# EAGLE design pi-shield (EAGLE 6.6.0)
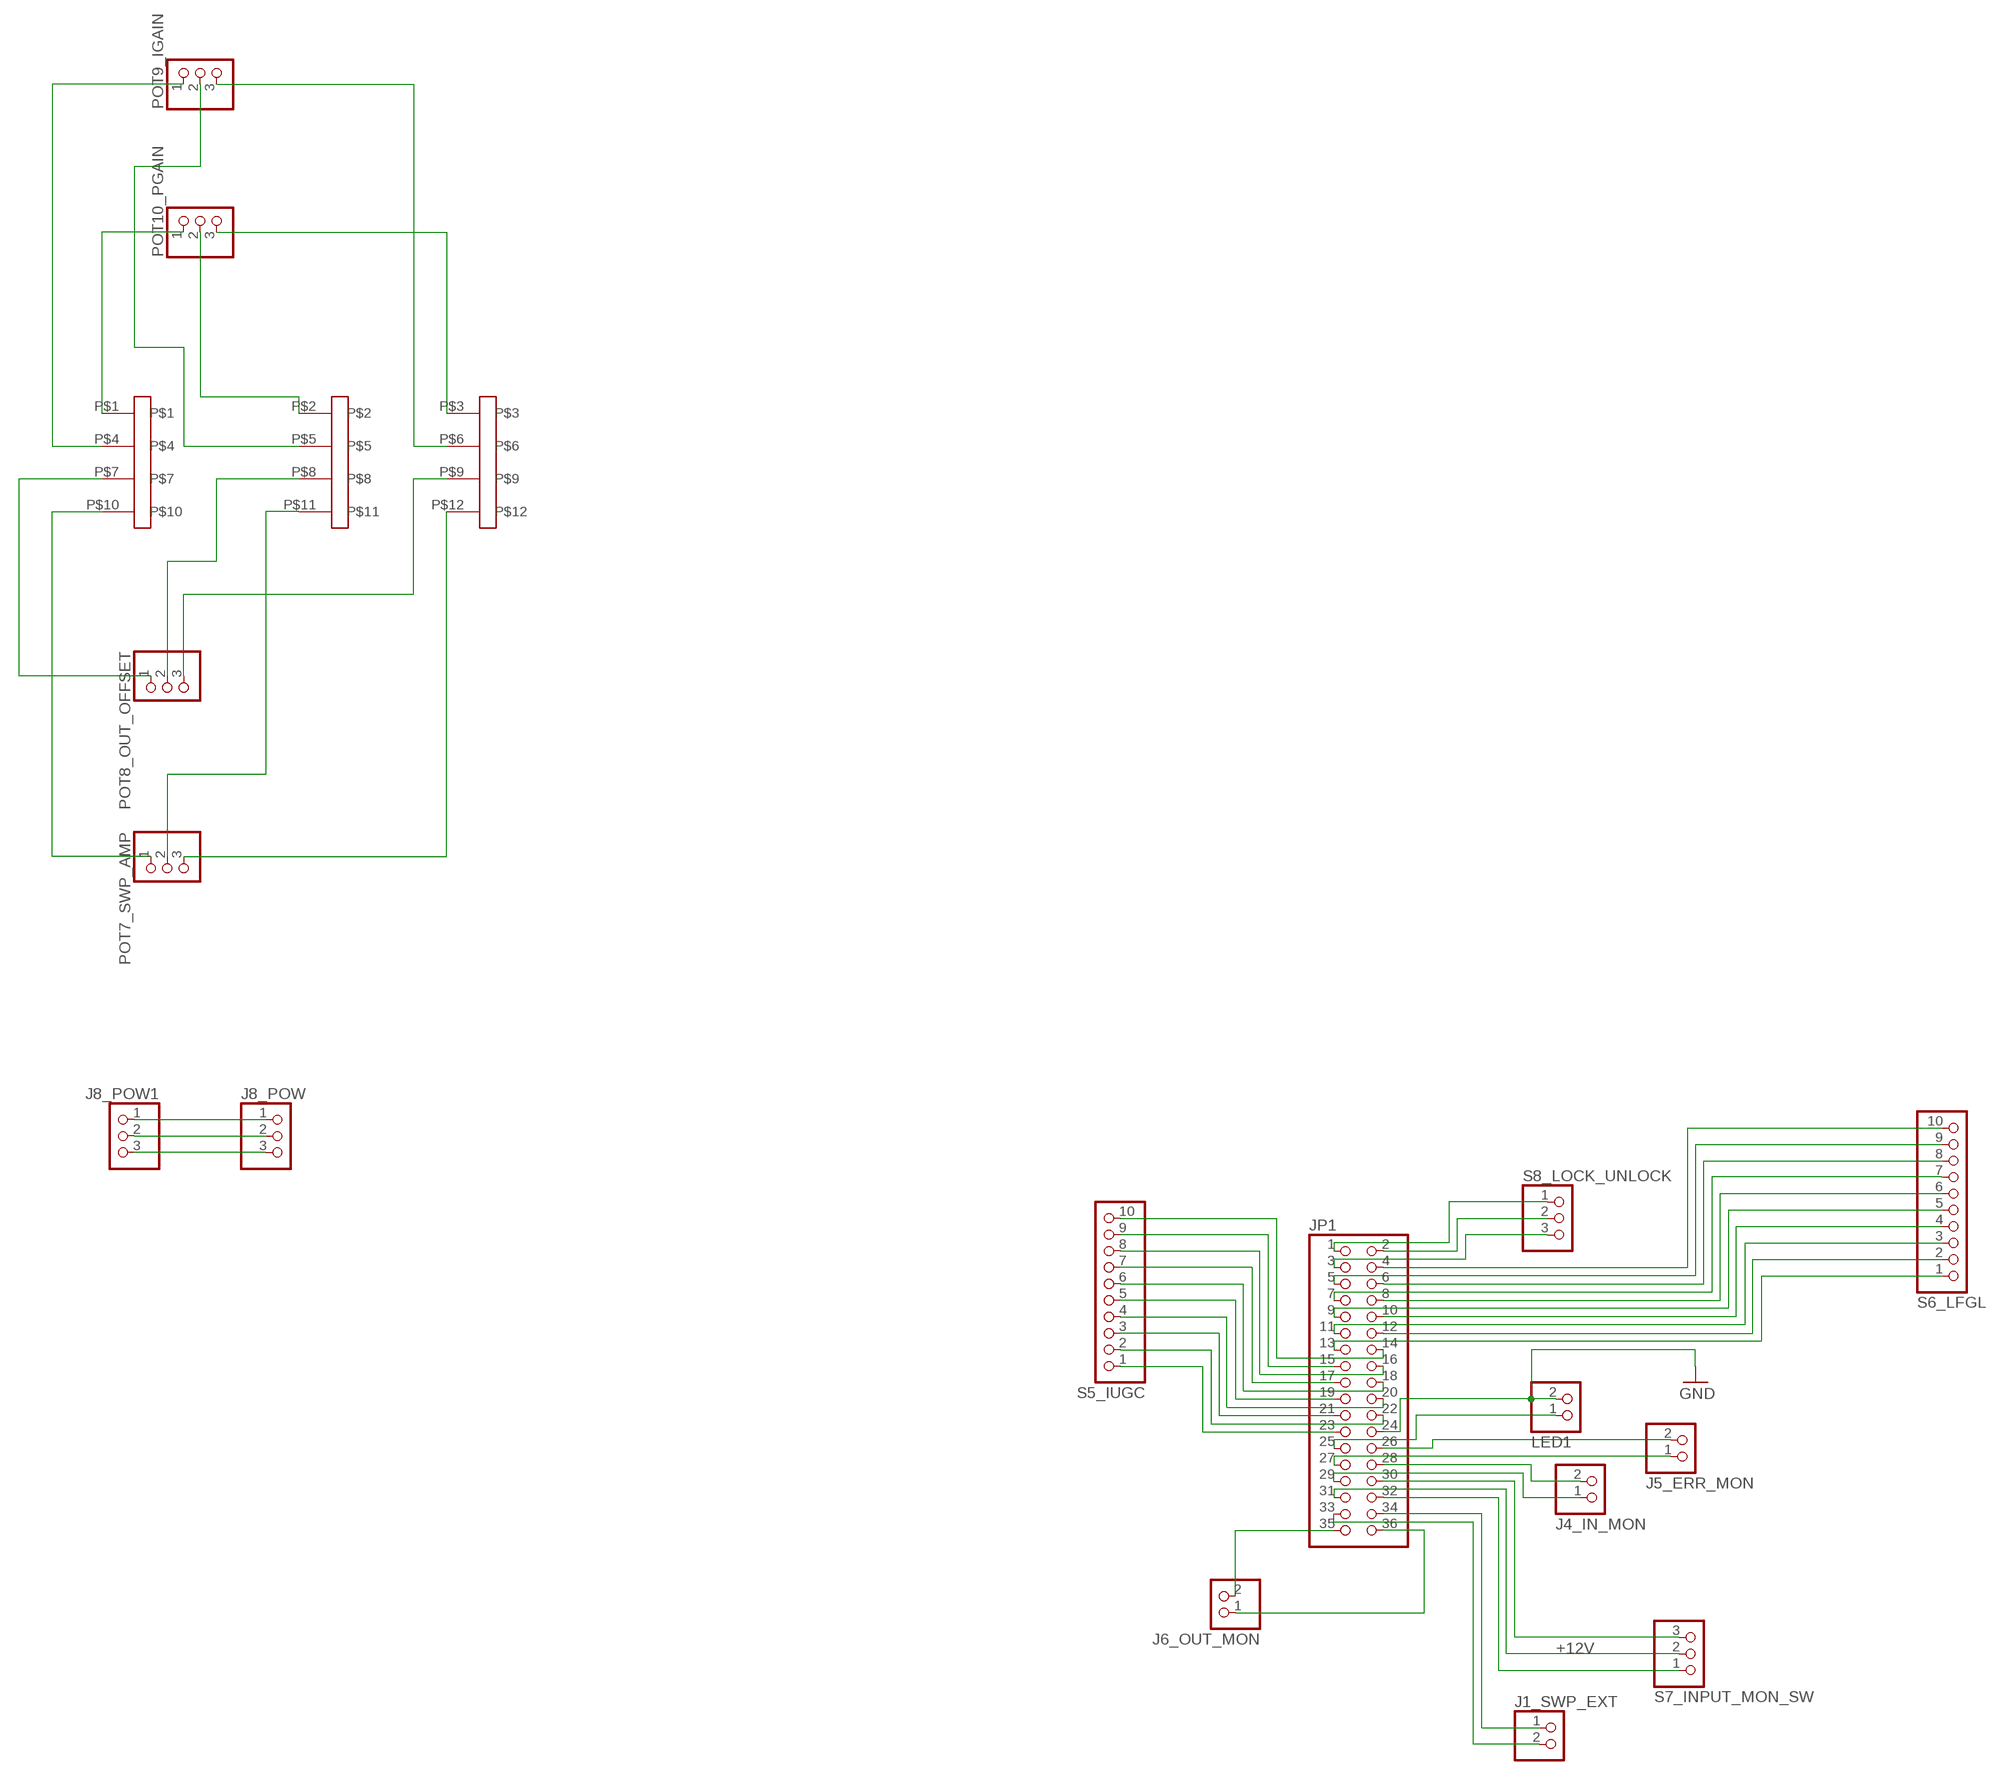
[diagram p0: schematic, sheet 1]

## Parts
J1  PINHD-3X4  [3X04]
J1_SWP_EXT  PINHD-1X2  [1X02]
J4_IN_MON  PINHD-1X2  [1X02]
J5_ERR_MON  PINHD-1X2  [1X02]
J6_OUT_MON  PINHD-1X2  [1X02]
J8_POW  PINHD-1X3  [1X03]
J8_POW1  PINHD-1X3  [1X03]
JP1  PINHD-2X18/90  [2X18/90]
LED1  PINHD-1X2  [1X02]
POT7_SWP_AMP  PINHD-1X3  [1X03]
POT8_OUT_OFFSET  PINHD-1X3  [1X03]
POT9_IGAIN  PINHD-1X3  [1X03]
POT10_PGAIN  PINHD-1X3  [1X03]
S5_IUGC  PINHD-1X10  [1X10]
S6_LFGL  PINHD-1X10  [1X10]
S7_INPUT_MON_SW  PINHD-1X3  [1X03]
S8_LOCK_UNLOCK  PINHD-1X3  [1X03]

## Nets
+12V: JP1.31 S7_INPUT_MON_SW.2
GND: JP1.24 LED1.2
N$1: J8_POW1.1 J8_POW.1
N$2: J8_POW1.2 J8_POW.2
N$3: J8_POW1.3 J8_POW.3
N$4: J1.P$1 POT10_PGAIN.1
N$5: J1.P$2 POT10_PGAIN.2
N$6: J1.P$3 POT10_PGAIN.3
N$7: J1.P$4 POT9_IGAIN.1
N$8: J1.P$5 POT9_IGAIN.2
N$9: J1.P$6 POT9_IGAIN.3
N$10: J1.P$7 POT8_OUT_OFFSET.1
N$11: J1.P$8 POT8_OUT_OFFSET.2
N$12: J1.P$9 POT8_OUT_OFFSET.3
N$13: J1.P$10 POT7_SWP_AMP.1
N$14: J1.P$11 POT7_SWP_AMP.2
N$15: J1.P$12 POT7_SWP_AMP.3
N$16: J1_SWP_EXT.1 JP1.34
N$17: J1_SWP_EXT.2 JP1.33
N$18: J5_ERR_MON.2 JP1.26
N$19: J5_ERR_MON.1 JP1.27
N$20: J4_IN_MON.2 JP1.28
N$21: J4_IN_MON.1 JP1.29
N$22: JP1.30 S7_INPUT_MON_SW.3
N$23: JP1.32 S7_INPUT_MON_SW.1
N$24: JP1.4 S6_LFGL.10
N$25: JP1.5 S6_LFGL.9
N$26: JP1.6 S6_LFGL.8
N$27: JP1.7 S6_LFGL.7
N$28: JP1.8 S6_LFGL.6
N$29: JP1.9 S6_LFGL.5
N$30: JP1.10 S6_LFGL.4
N$31: JP1.11 S6_LFGL.3
N$32: JP1.12 S6_LFGL.2
N$33: JP1.13 S6_LFGL.1
N$34: JP1.14 S5_IUGC.10
N$35: JP1.15 S5_IUGC.9
N$36: JP1.1 S8_LOCK_UNLOCK.1
N$37: JP1.16 S5_IUGC.8
N$38: JP1.17 S5_IUGC.7
N$39: JP1.18 S5_IUGC.6
N$40: JP1.19 S5_IUGC.5
N$41: JP1.20 S5_IUGC.4
N$42: JP1.21 S5_IUGC.3
N$43: JP1.22 S5_IUGC.2
N$44: JP1.23 S5_IUGC.1
N$45: JP1.25 LED1.1
N$46: JP1.2 S8_LOCK_UNLOCK.2
N$47: JP1.3 S8_LOCK_UNLOCK.3
N$48: J6_OUT_MON.2 JP1.35
N$49: J6_OUT_MON.1 JP1.36

## Library data of the parts
J1 = pinhead:PINHD-3X4; PARTNO: S7071-ND (2x)
J1_SWP_EXT J4_IN_MON J5_ERR_MON J6_OUT_MON LED1 = pinhead:PINHD-1X2: PIN HEADER; PARTNO: S7000-ND
J8_POW POT7_SWP_AMP POT8_OUT_OFFSET POT9_IGAIN POT10_PGAIN S7_INPUT_MON_SW S8_LOCK_UNLOCK = pinhead:PINHD-1X3: PIN HEADER; PARTNO: S7036-ND
J8_POW1 = pinhead:PINHD-1X3: PIN HEADER; PARTNO: A19470-ND
JP1 = pinhead:PINHD-2X18: PIN HEADER; PARTNO: S2111EC-18-ND
S5_IUGC S6_LFGL = pinhead:PINHD-1X10: PIN HEADER; PARTNO: S7008-ND

## Board
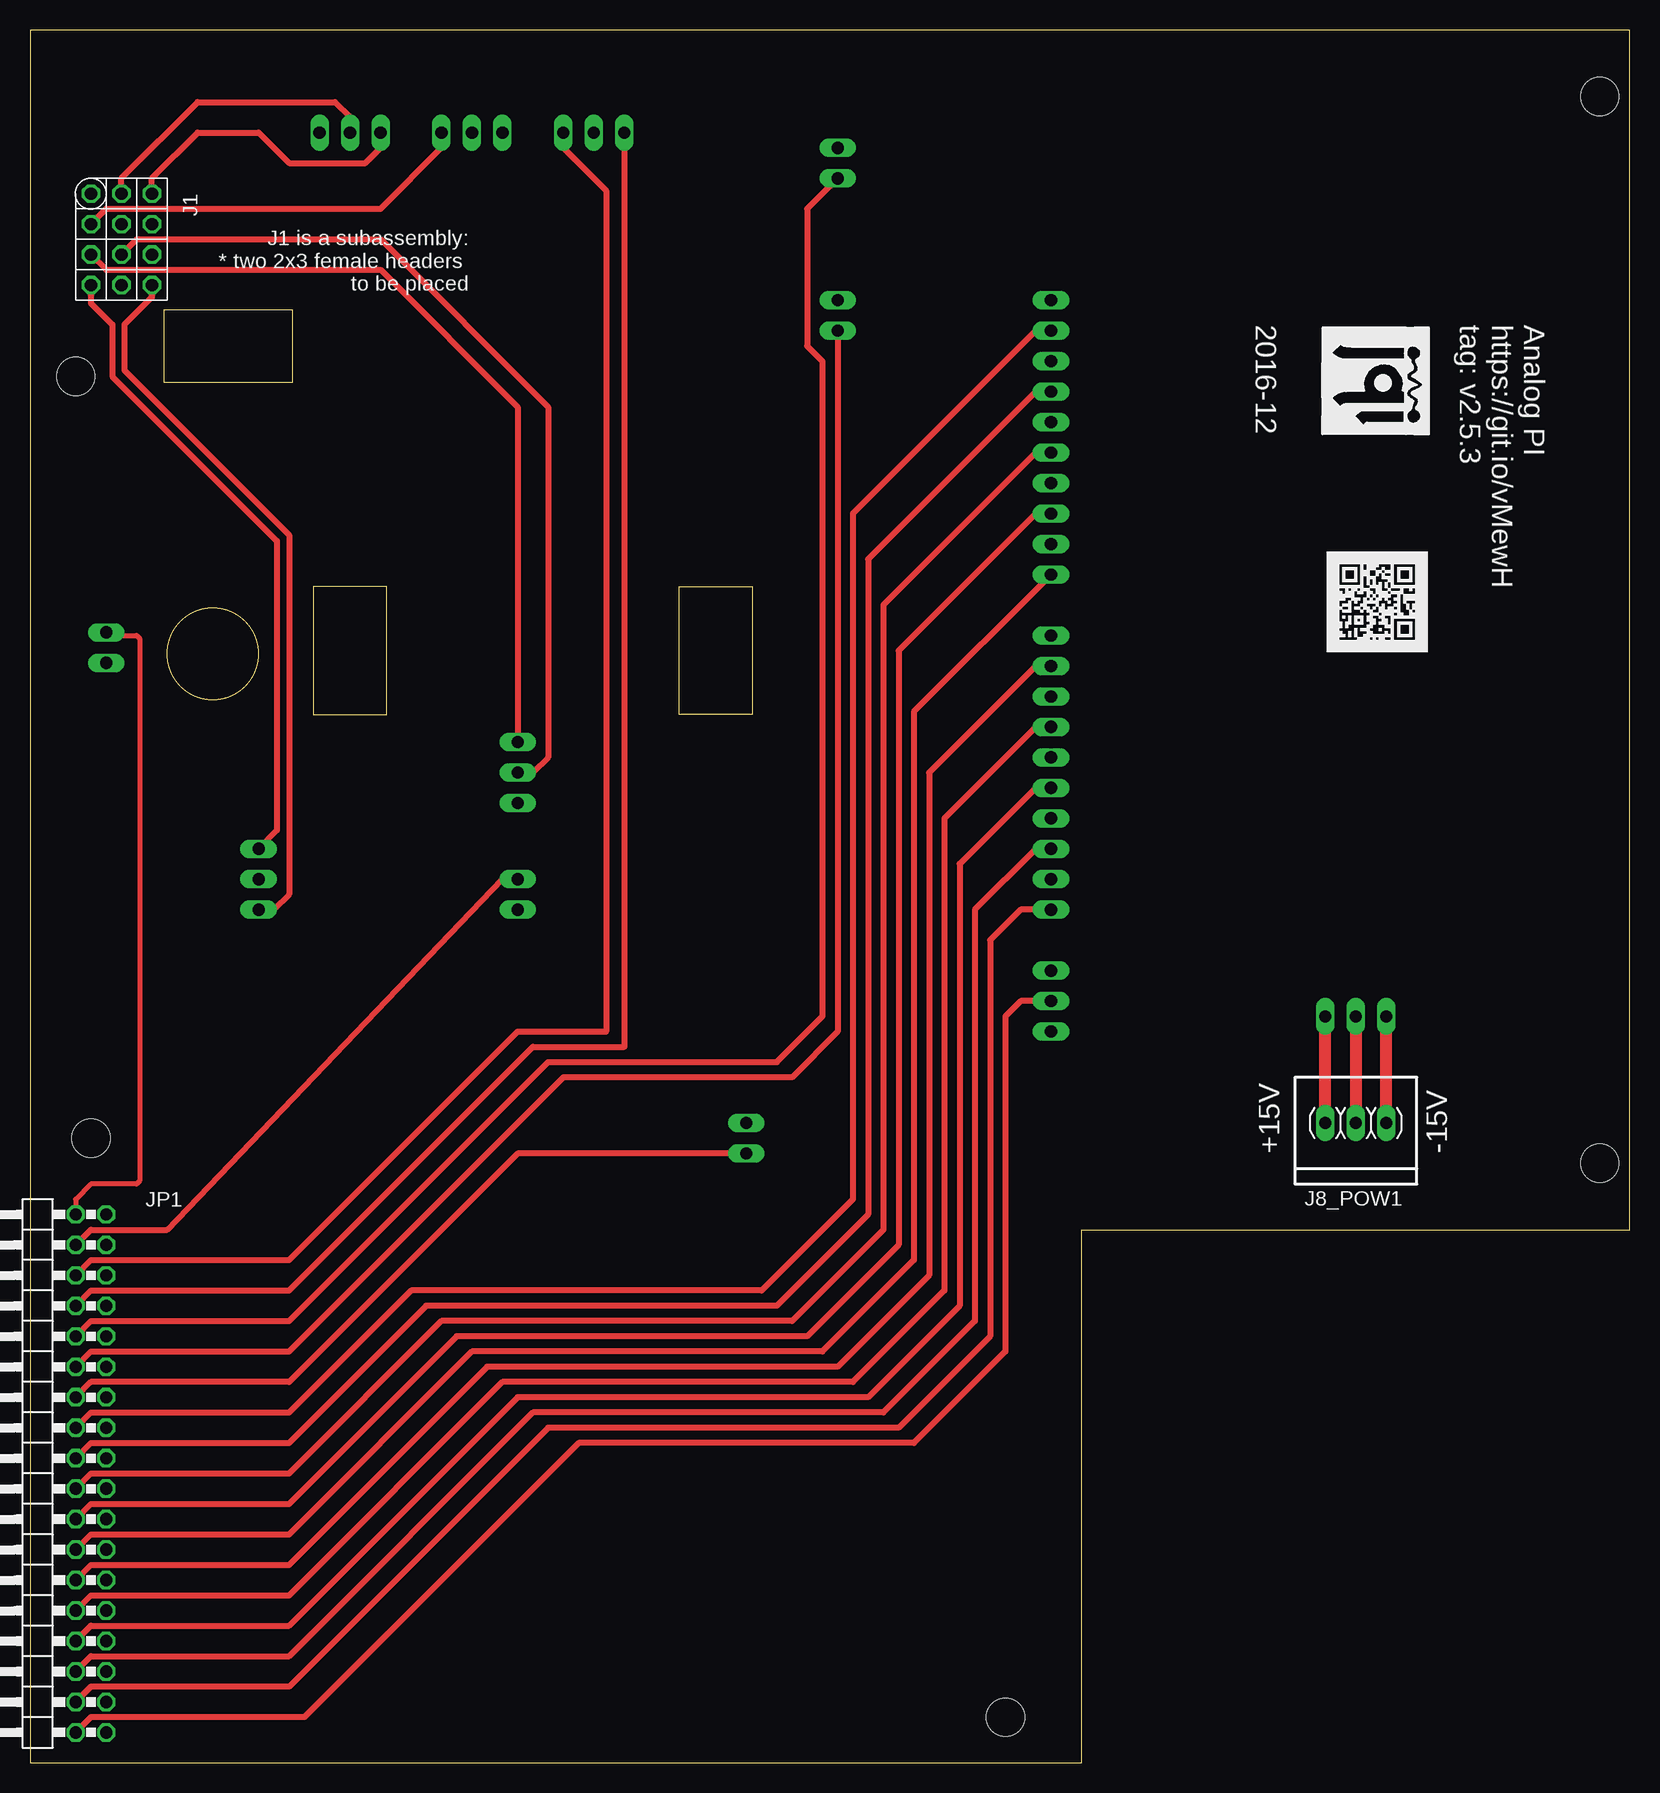
[diagram p1: board, top side]
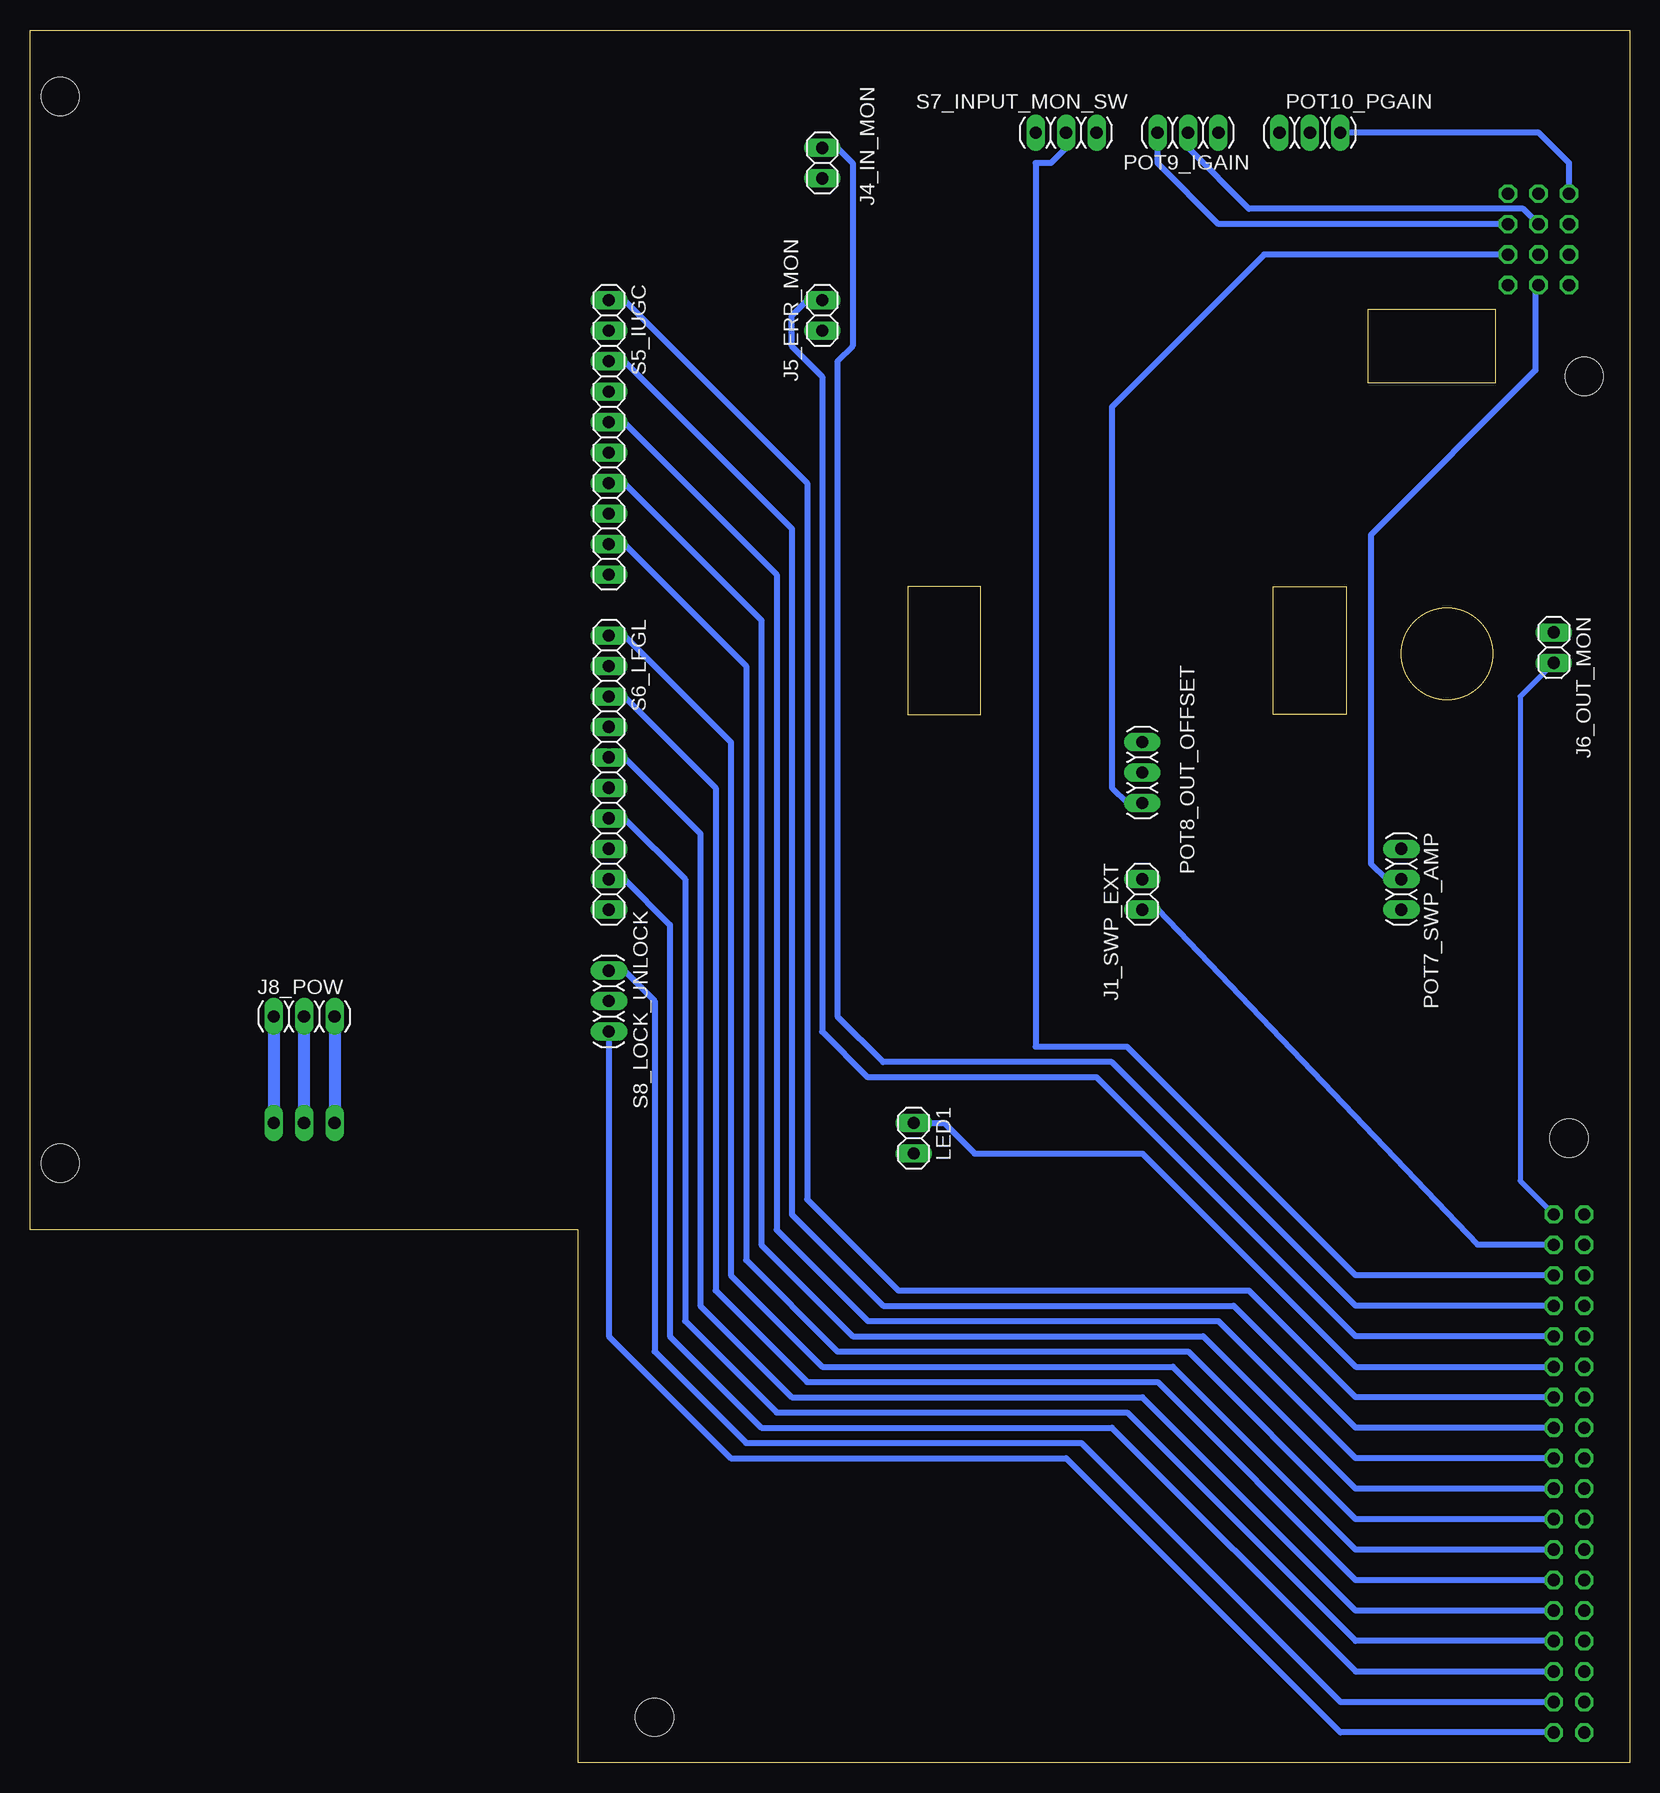
[diagram p2: board, bottom side, seen from below]

Size 133.33 x 144.45 mm. Coordinates in mm from the lower left corner, seen from the top.
Outline: 0,0 87.63,0 87.63,44.45 133.33,44.45 133.33,144.45 0,144.45 0,0
Outline: 54.1,87.38 54.1,98.04 60.2,98.04 60.2,87.38 54.1,87.38
Outline: 23.62,87.38 29.72,87.38 29.72,98.04 23.62,98.04 23.62,87.38
Outline: 11.18,115.06 11.18,121.16 21.84,121.16 21.84,115.06 11.18,115.06
Outline: circle at 15.24,92.46 radius 3.81
Copper layers (1*16): Top 0.035mm / dielectric 1.5mm / Bottom 0.035mm
Design rules "MF_Standard_2_Layer": minimum track width 5mil, minimum drill 10mil, track to track 5mil, track to pad 5mil, pad to pad 5mil, via to via 5mil, smd to smd 0mil, copper to edge 10mil, drill to drill 10mil, minimum pad ring 4mil, minimum via ring 4mil, stop-mask expansion 2mil, vias tented up to drill 25mil, thermal gap 10mil
Holes 3.17 mm at 130.81,50 130.81,138.9 3.81,115.57 81.28,3.81 5.08,52.07

### Footprints (pad centres in the part's own frame; a part is rotated, then mirrored left to right if it is on the bottom)
3X04 = drill 1.016 octagon: P$1 -5.08,-2.54; P$2 -5.08,0; P$3 -5.08,2.54; P$4 -2.54,-2.54; P$5 -2.54,0; P$6 -2.54,2.54; P$7 0,-2.54; P$8 0,0; P$9 0,2.54; P$10 2.54,-2.54; P$11 2.54,0; P$12 2.54,2.54
1X02 = drill 1.016 long: 1 -1.27,0; 2 1.27,0
1X03 = drill 1.016 long: 1 -2.54,0; 2 0,0; 3 2.54,0
2X18/90 = drill 1.016 octagon: 1 -21.59,-6.35; 2 -21.59,-3.81; 3 -19.05,-6.35; 4 -19.05,-3.81; 5 -16.51,-6.35; 6 -16.51,-3.81; 7 -13.97,-6.35; 8 -13.97,-3.81; 9 -11.43,-6.35; 10 -11.43,-3.81; 11 -8.89,-6.35; 12 -8.89,-3.81; 13 -6.35,-6.35; 14 -6.35,-3.81; 15 -3.81,-6.35; 16 -3.81,-3.81; 17 -1.27,-6.35; 18 -1.27,-3.81; 19 1.27,-6.35; 20 1.27,-3.81; 21 3.81,-6.35; 22 3.81,-3.81; 23 6.35,-6.35; 24 6.35,-3.81; 25 8.89,-6.35; 26 8.89,-3.81; 27 11.43,-6.35; 28 11.43,-3.81; 29 13.97,-6.35; 30 13.97,-3.81; 31 16.51,-6.35; 32 16.51,-3.81; 33 19.05,-6.35; 34 19.05,-3.81; 35 21.59,-6.35; 36 21.59,-3.81
1X10 = drill 1.016 long: 1 -11.43,0; 2 -8.89,0; 3 -6.35,0; 4 -3.81,0; 5 -1.27,0; 6 1.27,0; 7 3.81,0; 8 6.35,0; 9 8.89,0; 10 11.43,0

### Placement (x,y rotation side)
J1  7.62,125.73 270 top
J1_SWP_EXT  40.64,72.39 270 bottom
J4_IN_MON  67.31,133.35 270 bottom
J5_ERR_MON  67.31,120.65 270 bottom
J6_OUT_MON  6.35,92.96 270 bottom
J8_POW  110.49,62.23 0 bottom
J8_POW1  110.49,53.34 180 top
JP1  0,24.13 90 top
LED1  59.69,52.07 270 bottom
POT7_SWP_AMP  19.05,73.66 270 bottom
POT8_OUT_OFFSET  40.64,82.55 270 bottom
POT9_IGAIN  36.83,135.89 180 bottom
POT10_PGAIN  26.67,135.89 180 bottom
S5_IUGC  85.09,110.49 270 bottom
S6_LFGL  85.09,82.55 270 bottom
S7_INPUT_MON_SW  46.99,135.89 180 bottom
S8_LOCK_UNLOCK  85.09,63.5 90 bottom
U$1  [QR-HTTPS://GIT.IO/VMEWH-LIGHT-SILK]  112.27,96.77 270 top
U$2  [JQI_LOGO_NEGATIVE-SILKSCREEN]  107.7,119.63 270 top

### Tracks (layer width: path | path; a pad name or v marks a point on that pad's centre or on a via)
+12V
  Bottom 0.508: S7_INPUT_MON_SW.2 46.99,134.62 48.26,133.35 49.53,133.35 49.53,59.69 41.91,59.69 22.86,40.64 JP1.31
GND
  Top 0.508: LED1.2 40.64,50.8 21.59,31.75 5.08,31.75 JP1.24
N$1
  Top 1.016: J8_POW1.1 J8_POW.1
  Bottom 1.016: J8_POW.1 J8_POW1.1
N$2
  Top 1.016: J8_POW.2 J8_POW1.2
  Bottom 1.016: J8_POW1.2 J8_POW.2
N$3
  Top 1.016: J8_POW1.3 J8_POW.3
  Bottom 1.016: J8_POW.3 J8_POW1.3
N$4
  Bottom 0.508: J1.P$1 5.08,133.35 7.62,135.89 POT10_PGAIN.1
N$5
  Top 0.508: J1.P$2 7.62,132.08 13.97,138.43 25.4,138.43 26.67,137.16 POT10_PGAIN.2
N$6
  Top 0.508: J1.P$3 10.16,132.08 13.97,135.89 19.05,135.89 21.59,133.35 27.94,133.35 29.21,134.62 POT10_PGAIN.3
N$7
  Top 0.508: J1.P$4 6.35,129.54 29.21,129.54 34.29,134.62 POT9_IGAIN.1
N$8
  Bottom 0.508: J1.P$5 8.89,129.54 31.75,129.54 36.83,134.62 POT9_IGAIN.2
N$9
  Bottom 0.508: J1.P$6 34.29,128.27 39.37,133.35 POT9_IGAIN.3
N$10
  Top 0.508: J1.P$7 6.35,124.46 29.21,124.46 40.64,113.03 POT8_OUT_OFFSET.1
N$11
  Top 0.508: J1.P$8 8.89,127 29.21,127 43.18,113.03 43.18,83.82 41.91,82.55 POT8_OUT_OFFSET.2
N$12
  Bottom 0.508: J1.P$9 30.48,125.73 43.18,113.03 43.18,81.28 41.91,80.01 POT8_OUT_OFFSET.3
N$13
  Top 0.508: J1.P$10 5.08,121.67 6.86,119.89 6.86,115.57 20.57,101.85 20.57,77.72 POT7_SWP_AMP.1
N$14
  Bottom 0.508: J1.P$11 7.87,122.94 7.87,116.08 21.59,102.36 21.59,74.93 20.32,73.66 POT7_SWP_AMP.2
N$15
  Top 0.508: J1.P$12 10.16,122.17 7.87,119.89 7.87,116.08 21.59,102.36 21.59,72.39 20.32,71.12 POT7_SWP_AMP.3
N$16
  Top 0.508: JP1.34 5.08,44.45 11.43,44.45 39.37,73.66 J1_SWP_EXT.1
N$17
  Bottom 0.508: JP1.33 12.7,43.18 39.37,71.12 J1_SWP_EXT.2
N$18
  Top 0.508: J5_ERR_MON.2 67.31,60.96 63.5,57.15 44.45,57.15 21.59,34.29 5.08,34.29 JP1.26
N$19
  Bottom 0.508: J5_ERR_MON.1 68.58,121.92 69.85,120.65 69.85,118.11 67.31,115.57 67.31,60.96 63.5,57.15 44.45,57.15 22.86,35.56 JP1.27
N$20
  Top 0.508: J4_IN_MON.2 64.77,129.54 64.77,118.11 66.04,116.84 66.04,62.23 62.23,58.42 43.18,58.42 21.59,36.83 5.08,36.83 JP1.28
N$21
  Bottom 0.508: J4_IN_MON.1 66.04,134.62 64.77,133.35 64.77,118.11 66.04,116.84 66.04,62.23 62.23,58.42 43.18,58.42 22.86,38.1 JP1.29
N$22
  Top 0.508: S7_INPUT_MON_SW.3 49.53,59.69 41.91,59.69 21.59,39.37 5.08,39.37 JP1.30
N$23
  Top 0.508: S7_INPUT_MON_SW.1 44.45,134.62 48.01,131.06 48.01,60.96 40.64,60.96 21.59,41.91 5.08,41.91 JP1.32
N$24
  Top 0.508: S6_LFGL.10 82.55,71.12 80.01,68.58 80.01,35.56 72.39,27.94 43.18,27.94 21.59,6.35 5.08,6.35 JP1.4
N$25
  Bottom 0.508: S6_LFGL.9 83.82,73.66 80.01,69.85 80.01,35.56 72.39,27.94 43.18,27.94 22.86,7.62 JP1.5
N$26
  Top 0.508: S6_LFGL.8 83.82,76.2 78.74,71.12 78.74,36.83 71.12,29.21 41.91,29.21 21.59,8.89 5.08,8.89 JP1.6
N$27
  Bottom 0.508: S6_LFGL.7 83.82,78.74 78.74,73.66 78.74,36.83 71.12,29.21 41.91,29.21 22.86,10.16 JP1.7
N$28
  Top 0.508: S6_LFGL.6 83.82,81.28 77.47,74.93 77.47,38.1 69.85,30.48 40.64,30.48 21.59,11.43 5.08,11.43 JP1.8
N$29
  Bottom 0.508: S6_LFGL.5 83.82,83.82 77.47,77.47 77.47,38.1 69.85,30.48 40.64,30.48 22.86,12.7 JP1.9
N$30
  Top 0.508: S6_LFGL.4 83.82,86.36 76.2,78.74 76.2,39.37 68.58,31.75 39.37,31.75 21.59,13.97 5.08,13.97 JP1.10
N$31
  Bottom 0.508: S6_LFGL.3 83.82,88.9 76.2,81.28 76.2,39.37 68.58,31.75 39.37,31.75 22.86,15.24 JP1.11
N$32
  Top 0.508: S6_LFGL.2 83.82,91.44 74.93,82.55 74.93,40.64 67.31,33.02 38.1,33.02 21.59,16.51 5.08,16.51 JP1.12
N$33
  Bottom 0.508: S6_LFGL.1 83.82,93.98 74.93,85.09 74.93,40.64 67.31,33.02 38.1,33.02 22.86,17.78 JP1.13
N$34
  Top 0.508: S5_IUGC.10 73.66,87.63 73.66,41.91 66.04,34.29 36.83,34.29 21.59,19.05 5.08,19.05 JP1.14
N$35
  Bottom 0.508: S5_IUGC.9 83.82,101.6 73.66,91.44 73.66,41.91 66.04,34.29 36.83,34.29 22.86,20.32 JP1.15
N$36
  Bottom 0.508: S8_LOCK_UNLOCK.1 85.09,35.56 74.93,25.4 46.99,25.4 24.13,2.54 JP1.1
N$37
  Top 0.508: S5_IUGC.8 83.82,104.14 72.39,92.71 72.39,43.18 64.77,35.56 35.56,35.56 21.59,21.59 5.08,21.59 JP1.16
N$38
  Bottom 0.508: S5_IUGC.7 83.82,106.68 72.39,95.25 72.39,43.18 64.77,35.56 35.56,35.56 22.86,22.86 JP1.17
N$39
  Top 0.508: S5_IUGC.6 83.82,109.22 71.12,96.52 71.12,44.45 63.5,36.83 34.29,36.83 21.59,24.13 5.08,24.13 JP1.18
N$40
  Bottom 0.508: S5_IUGC.5 83.82,111.76 71.12,99.06 71.12,44.45 63.5,36.83 34.29,36.83 22.86,25.4 JP1.19
N$41
  Top 0.508: S5_IUGC.4 83.82,114.3 69.85,100.33 69.85,45.72 62.23,38.1 33.02,38.1 21.59,26.67 5.08,26.67 JP1.20
N$42
  Bottom 0.508: S5_IUGC.3 83.82,116.84 69.85,102.87 69.85,45.72 62.23,38.1 33.02,38.1 22.86,27.94 JP1.21
N$43
  Top 0.508: S5_IUGC.2 83.82,119.38 68.58,104.14 68.58,46.99 60.96,39.37 31.75,39.37 21.59,29.21 5.08,29.21 JP1.22
N$44
  Bottom 0.508: S5_IUGC.1 83.82,121.92 68.58,106.68 68.58,46.99 60.96,39.37 31.75,39.37 22.86,30.48 JP1.23
N$45
  Bottom 0.508: LED1.1 57.15,53.34 54.61,50.8 40.64,50.8 22.86,33.02 JP1.25
N$46
  Top 0.508: S8_LOCK_UNLOCK.2 82.55,63.5 81.28,62.23 81.28,34.29 73.66,26.67 45.72,26.67 22.86,3.81 5.08,3.81 JP1.2
N$47
  Bottom 0.508: S8_LOCK_UNLOCK.3 83.82,66.04 81.28,63.5 81.28,34.29 73.66,26.67 45.72,26.67 24.13,5.08 JP1.3
N$48
  Bottom 0.406: J6_OUT_MON.2 9.14,88.9 9.14,48.51 JP1.35
N$49
  Top 0.406: J6_OUT_MON.1 6.6,93.98 8.89,93.98 9.14,93.73 9.14,48.51 8.89,48.26 5.08,48.26 3.81,46.99 JP1.36

### Text on the board
tPlace: J1 is a subassembly: / * two 2x3 female headers / to be placed | 2016-12 | Analog PI / https://git.io/vMewH / tag: v2.5.3 | +15V | -15V